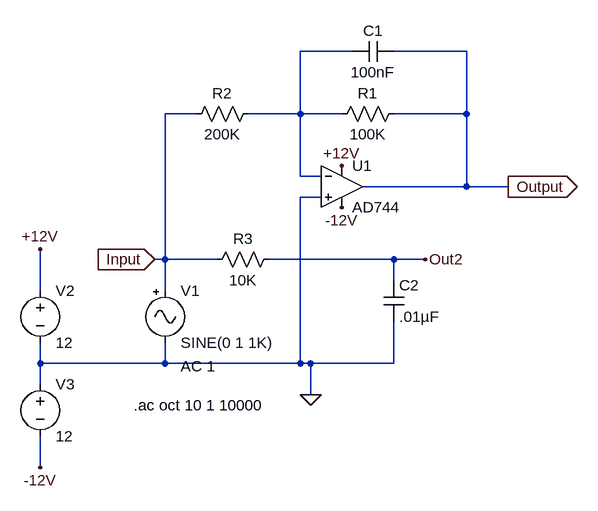
[diagram p0: schematic op_int_rc.asc]
op_int_rc.asc, the LTspice schematic file:
Version 4
SHEET 1 880 680
WIRE 224 -240 144 -240
WIRE 400 -240 288 -240
WIRE -16 -144 -64 -144
WIRE 144 -144 144 -240
WIRE 144 -144 64 -144
WIRE 208 -144 144 -144
WIRE 400 -144 400 -240
WIRE 400 -144 288 -144
WIRE 144 -48 144 -144
WIRE 176 -48 144 -48
WIRE 400 -32 400 -144
WIRE 400 -32 240 -32
WIRE 464 -32 400 -32
WIRE 176 -16 144 -16
WIRE -64 80 -64 -144
WIRE -64 80 -80 80
WIRE 16 80 -64 80
WIRE 288 80 96 80
WIRE 336 80 288 80
WIRE 288 112 288 80
WIRE -256 128 -256 64
WIRE -64 128 -64 80
WIRE -256 240 -256 208
WIRE -64 240 -64 208
WIRE -64 240 -256 240
WIRE 144 240 144 -16
WIRE 144 240 -64 240
WIRE 160 240 144 240
WIRE 288 240 288 176
WIRE 288 240 160 240
WIRE -256 272 -256 240
WIRE 160 288 160 240
WIRE -256 400 -256 352
FLAG -80 80 Input
IOPIN -80 80 In
FLAG 464 -32 Output
IOPIN 464 -32 Out
FLAG 160 288 0
FLAG -256 64 +12V
FLAG 208 -64 +12V
FLAG -256 400 -12V
FLAG 208 0 -12V
FLAG 336 80 Out2
SYMBOL res 304 -160 R90
WINDOW 0 0 56 VBottom 2
WINDOW 3 32 56 VTop 2
SYMATTR InstName R1
SYMATTR Value 100K
SYMBOL cap 288 -256 R90
WINDOW 0 0 32 VBottom 2
WINDOW 3 32 32 VTop 2
SYMATTR InstName C1
SYMATTR Value 100nF
SYMBOL Misc\\signal -64 112 R0
WINDOW 123 24 132 Left 2
WINDOW 39 0 0 Left 0
SYMATTR Value2 AC 1
SYMATTR InstName V1
SYMBOL OpAmps\\AD744 208 -96 R0
SYMATTR InstName U1
SYMBOL res 80 -160 R90
WINDOW 0 0 56 VBottom 2
WINDOW 3 32 56 VTop 2
SYMATTR InstName R2
SYMATTR Value 200K
SYMBOL voltage -256 112 R0
WINDOW 123 0 0 Left 0
WINDOW 39 0 0 Left 0
SYMATTR InstName V2
SYMATTR Value 12
SYMBOL voltage -256 256 R0
WINDOW 123 0 0 Left 0
WINDOW 39 0 0 Left 0
SYMATTR InstName V3
SYMATTR Value 12
SYMBOL res 112 64 R90
WINDOW 0 0 56 VBottom 2
WINDOW 3 32 56 VTop 2
SYMATTR InstName R3
SYMATTR Value 10K
SYMBOL cap 272 112 R0
SYMATTR InstName C2
SYMATTR Value .01µF
TEXT -112 304 Left 2 !.ac oct 10 1 10000

The netlist it stands for:
* op_int_rc.asc
R1 Output N001 100K
C1 Output N001 100nF
V1 Input 0 SINE(0 1 1K) AC 1
XU1 0 N001 +12V -12V Output AD744  ; pins In+ In- V+ V- OUT
R2 N001 Input 200K
V2 +12V 0 12
V3 0 -12V 12
R3 Out2 Input 10K
C2 Out2 0 .01µF
.ac oct 10 1 10000
.backanno
.end